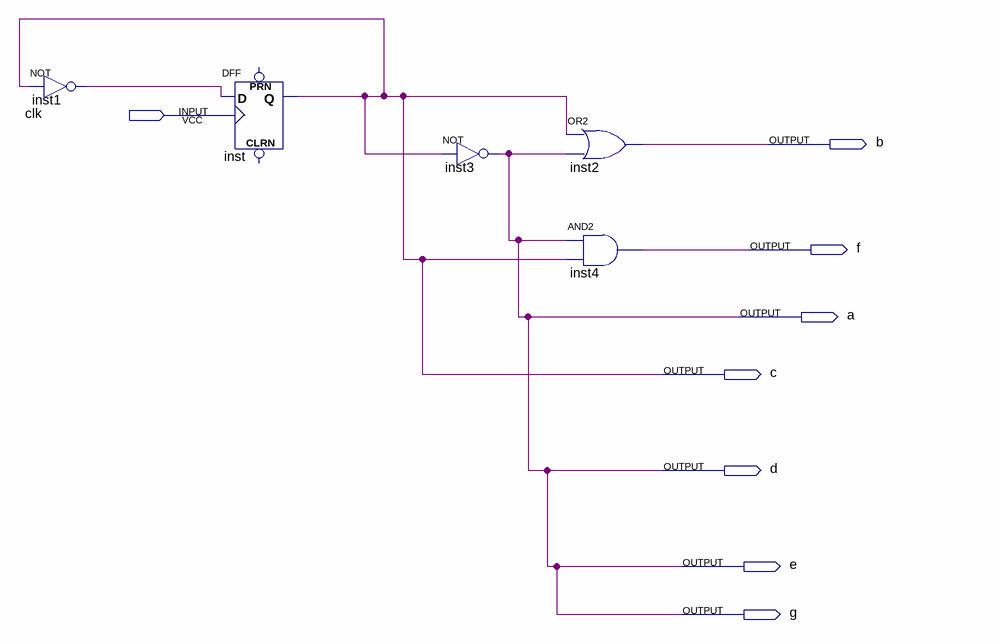
[diagram p0: schematic sheet]
// Quartus schematic YellowFND.bdf as structural Verilog: 5 symbols, 8 pins
module YellowFND (
  input  clk,
  output b,
  output f,
  output a,
  output c,
  output d,
  output e,
  output g
);

  wire inst1_out;

  not inst1 (inst1_out, c);
  DFF inst (.CLK(clk), .D(inst1_out), .Q(c));  // open: CLRN, PRN
  not inst3 (a, c);
  or inst2 (b, c, a);
  and inst4 (f, a, c);

  assign d = a;
  assign e = a;
  assign g = a;
endmodule
